# EAGLE design usb2serial-pic14f1454 (EAGLE 7.6.0)
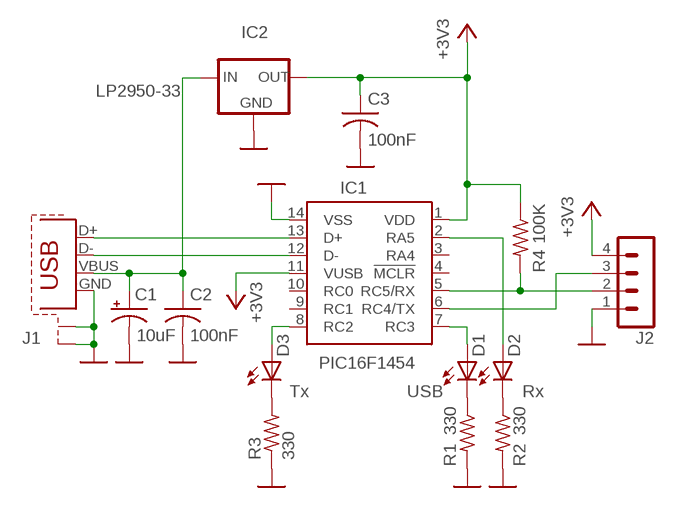
[diagram p0: schematic, sheet 1]

## Parts
C1  10uF  CPOL-USE2-4  [E2-4]
C2  100nF  C-US050-025X075  [C050-025X075]
C3  100nF  C-US050-025X075  [C050-025X075]
D1  LED5MM  [LED5MM]
D2  LED5MM  [LED5MM]
D3  LED5MM  [LED5MM]
IC1  PIC16F1454  [DIL14]
IC2  LP2950-33  78LXX  [78LXX]
J1  USB-SHIELD-A-H  [USB-A-H]
J2  J2  MA04-1  [MA04-1]
R1  330  R-US_0207/10  [0207/10]
R2  330  R-US_0207/10  [0207/10]
R3  330  R-US_0207/10  [0207/10]
R4  100K  R-US_0207/10  [0207/10]

## Nets
+3V3: C3.1 IC1.1(VDD) IC1.11(VUSB) IC2.OUT J2.4 R4.1
GND: C1.- C2.2 C3.2 IC1.14(VSS) IC2.GND J1.GND J1.GND2(S1) J1.GND3(S2) J2.1 R1.2 R2.2 R3.1
N$1: IC1.12(D-) J1.D-
N$2: IC1.13(D+) J1.D+
N$3: IC1.5(RC5/RX) J2.2 R4.2
N$4: D3.K(C) R3.2
N$5: D2.K(C) R2.1
N$6: C1.+ C2.1 IC2.IN J1.VBUS
N$9: D1.A IC1.7(RC3)
N$10: D1.K(C) R1.1
RA5: D2.A IC1.2(RA5)
RC2: D3.A IC1.8(RC2)
TX: IC1.6(RC4/TX) J2.3
Unconnected: IC1.3(RA4) IC1.4(!MCLR) IC1.9(RC1) IC1.10(RC0)

## Notes on the sheet
- Tx | USB | Rx

## Library data of the parts
C1 = rcl:CPOL-US: POLARIZED CAPACITOR, American symbol
C2 C3 = rcl:C-US: CAPACITOR, American symbol
D1-D3 = led:LED: LED OSRAM: - CHIPLED LG R971, LG N971, LY N971, LG Q971, LY Q971, LO R971, LY R971 LH N974, LH R974 LS Q976, LO Q976, LY Q976 LO Q996 - Hyper CHIPLED LW Q18S LB Q993, LB Q99A, LB R99A - SideLED LS A670, LO A670, LY A670, LG A670, LP A670 LB A673, LV A673, LT A673, LW A673 LH A674 LY A675 LS A676, LA A676, LO A676, LY A676, LW A676 LS A679, LY A679, LG A679 - Hyper Micro SIDELED® LS Y876, LA Y876, LO Y876, LY Y876 LT Y87S - SmartLED LW L88C, LW L88S LB L89C, LB L89S, LG L890 LS L89K, LO L89K, LY L89K LS L896, LA L896, LO L896, LY L896 - TOPLED LS T670, LO T670, LY T670, LG T670, LP T670 LSG T670, LSP T670, LSY T670, LOP T670, LYG T670 LG T671, LOG T671, LSG T671 LB T673, LV T673, LT T673, LW T673 LH T674 LS T676, LA T676, LO T676, LY T676, LB T676, LH T676, LSB T676, LW T676 LB T67C, LV T67C, LT T67C, LS T67K, LO T67K, LY T67K, LW E67C LS E67B, LA E67B, LO E67B, LY E67B, LB E67C, LV E67C, LT E67C LW T67C LS T679, LY T679, LG T679 LS T770, LO T770, LY T770, LG T770, LP T770 LB T773, LV T773, LT T773, LW T773 LH T774 LS E675, LA E675, LY E675, LS T675 LS T776, LA T776, LO T776, LY T776, LB T776 LHGB T686 LT T68C, LB T68C - Hyper Mini TOPLED® LB M676 - Mini TOPLED Santana® LG M470 LS M47K, LO M47K, LY M47K Source: http://www.osram.convergy.de/
IC1 = obddiag-net:PIC16F1454
IC2 = v-reg:78LXX: VOLTAGE REGULATOR
J1 = obddiag-net:USB-SHIELD
J2 = con-lstb:MA04-1: PIN HEADER; OC_FARNELL: unknown; OC_NEWARK: unknown
R1-R4 = rcl:R-US_: RESISTOR, American symbol

## Board
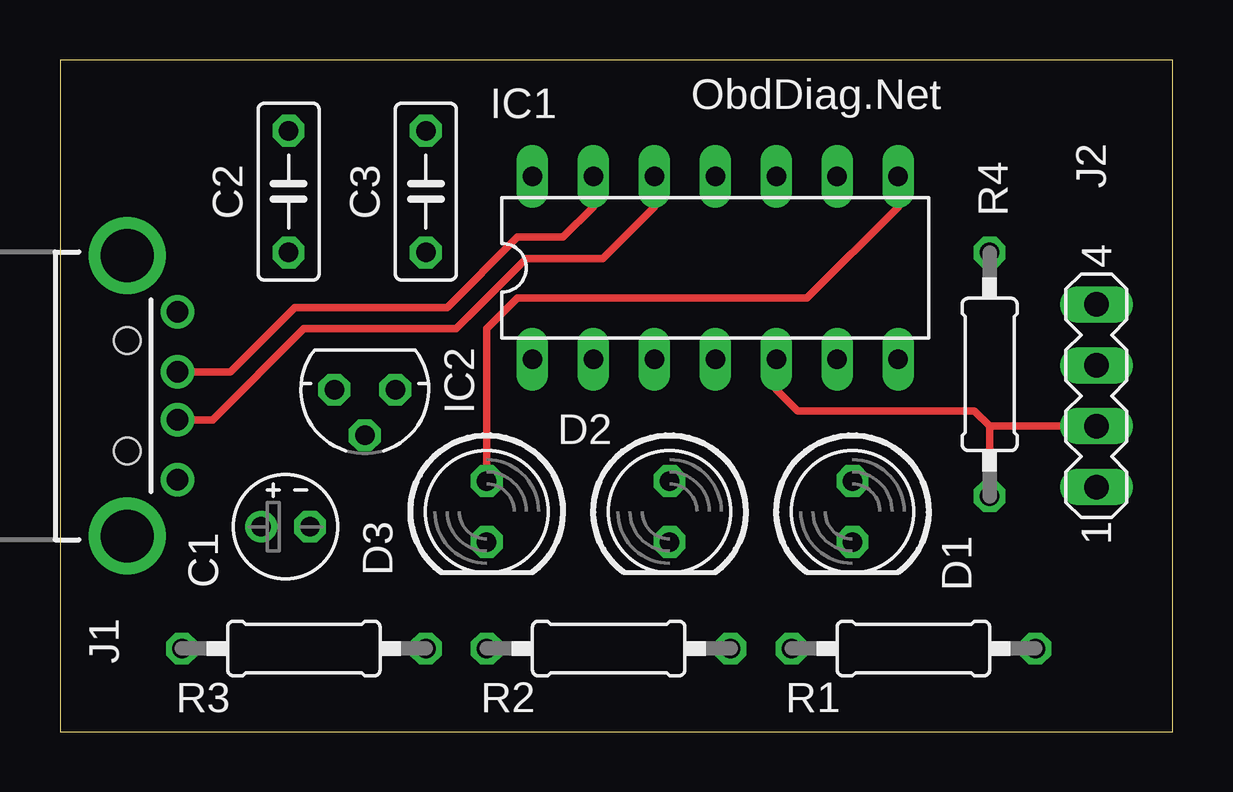
[diagram p1: board, top side]
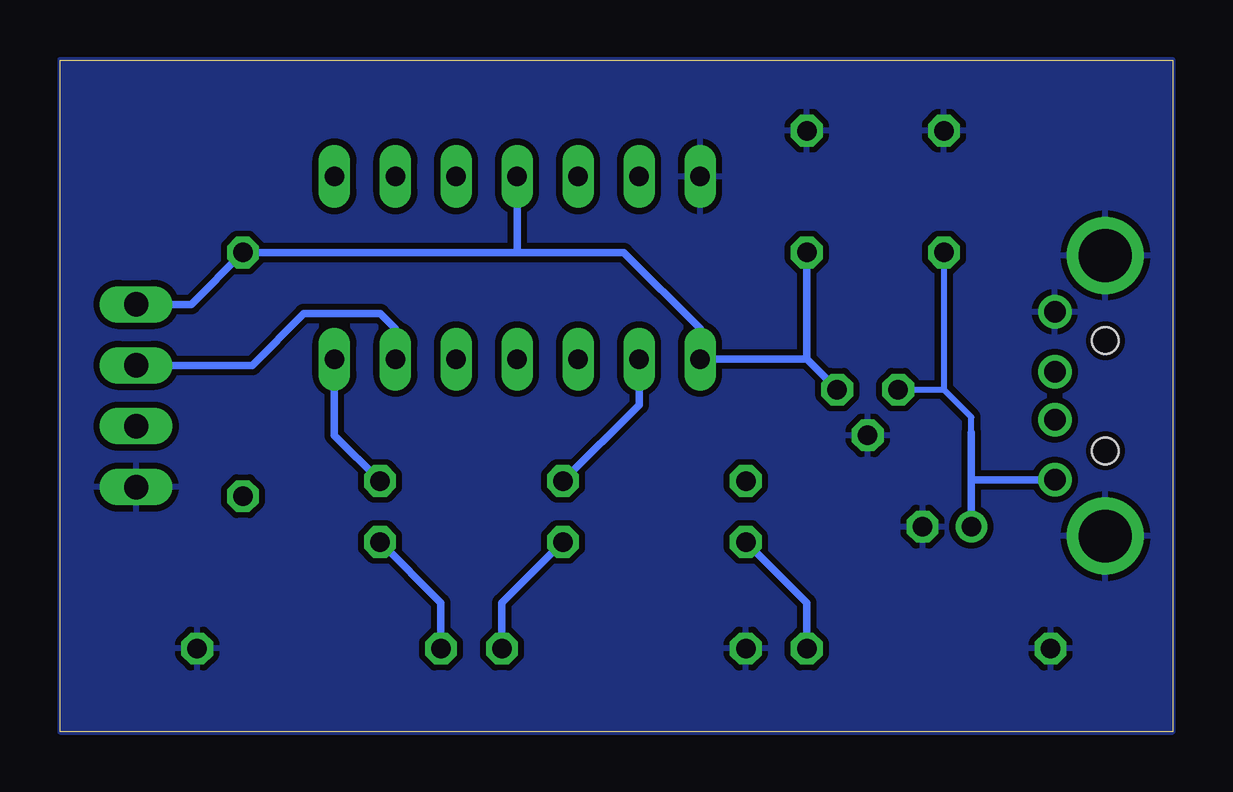
[diagram p2: board, bottom side, seen from below]

Size 46.35 x 28 mm. Coordinates in mm from the lower left corner, seen from the top.
Outline: 0,0 46.35,0 46.35,28 0,28 0,0
Copper layers (1*16): Top 0.035mm / dielectric 1.5mm / Bottom 0.035mm
Design rules "default": minimum track width 10mil, minimum drill 24mil, track to track 8mil, track to pad 8mil, pad to pad 8mil, via to via 8mil, smd to smd 8mil, copper to edge 0mil, drill to drill 8mil, minimum pad ring 10mil, minimum via ring 8mil, stop-mask expansion 4mil, vias tented up to drill 0mil, thermal gap 10mil

### Footprints (pad centres in the part's own frame; a part is rotated, then mirrored left to right if it is on the bottom)
E2-4 = drill 0.813 pad 1.27: + -1.016,0 | drill 0.813 pad 1.27 octagon: - 1.016,0
C050-025X075 = drill 0.813 octagon: 1 -2.54,0; 2 2.54,0
LED5MM = drill 0.813 octagon: A -1.27,0; K 1.27,0
DIL14 = drill 0.813 long: 1 -7.62,-3.81; 2 -5.08,-3.81; 3 -2.54,-3.81; 4 0,-3.81; 5 2.54,-3.81; 6 5.08,-3.81; 7 7.62,-3.81; 8 7.62,3.81; 9 5.08,3.81; 10 2.54,3.81; 11 0,3.81; 12 -2.54,3.81; 13 -5.08,3.81; 14 -7.62,3.81
78LXX = drill 0.813 octagon: GND 0,1.905; IN 1.27,0; OUT -1.27,0
USB-A-H = drill 0.9: D+ 2.1,1; D- 2.1,-1; GND 2.1,3.5; VBUS 2.1,-3.5 | drill 2.2: GND2 0,-5.85; GND3 0,5.85 | hole 1.1: 0,2.3; 0,-2.3
MA04-1 = drill 1.016 long: 1 -3.81,0; 2 -1.27,0; 3 1.27,0; 4 3.81,0
0207/10 = drill 0.813 octagon: 1 -5.08,0; 2 5.08,0

### Placement (x,y rotation side)
C1  9.4,8.54 0 top
C2  9.53,22.51 90 top
C3  15.24,22.51 90 top
D1  33.02,9.18 270 top
D2  25.4,9.18 270 top
D3  17.78,9.18 270 top
IC1  27.3,19.34 0 top
IC2  12.7,14.26 180 top
J1  2.8,14 0 top
J2  43.18,14 90 top
R1  35.56,3.46 0 top
R2  22.86,3.46 180 top
R3  10.16,3.46 0 top
R4  38.73,14.89 270 top

### Tracks (layer width: path | path; a pad name or v marks a point on that pad's centre or on a via)
+3V3
  Bottom 0.305: C3.1 15.24,15.53 | 27.3,19.97 22.86,19.97 19.68,16.8 IC1.1 15.24,15.53 | 27.3,19.97 R4.1 40.9,17.81 J2.4 | IC1.11 27.3,19.97 | IC2.OUT 15.24,15.53
GND
  pour Bottom (isolate 0.254): 0,0 0,28 46.35,28 46.35,0
N$1
  Top 0.305: J1.D- 6.37,13 10.16,16.8 16.51,16.8 19.43,19.72 22.61,19.72 24.77,21.88 IC1.12
N$2
  Top 0.305: J1.D+ 7.09,15 9.78,17.68 16.13,17.68 19.05,20.61 20.32,20.61 20.95,20.61 22.23,21.88 IC1.13
N$3
  Top 0.305: IC1.5 29.84,14.26 30.73,13.37 38.1,13.37 38.73,12.73 | J2.2 38.73,12.73 | R4.2 38.73,12.73
N$4
  Bottom 0.305: R3.2 15.24,5.37 D3.K
N$5
  Bottom 0.305: D2.K 27.94,5.37 R2.1
N$6
  Bottom 0.254: C2.1 9.53,14.26 | 9.53,14.26 8.38,13.11 8.38,12.48 | IC2.IN 9.53,14.26
  Bottom 0.305: J1.VBUS 8.38,10.5 | C1.+ 8.38,10.5 | 8.38,10.5 8.38,12.48
N$9
  Bottom 0.305: IC1.7 34.92,12.35 D1.A
N$10
  Bottom 0.305: R1.1 30.48,5.37 D1.K
RA5
  Bottom 0.305: IC1.2 22.23,13.62 D2.A
RC2
  Top 0.305: D3.A 17.78,16.8 19.05,18.06 31.11,18.06 34.92,21.88 IC1.8
TX
  Bottom 0.305: IC1.6 32.38,16.8 33.02,17.43 36.2,17.43 38.35,15.27 J2.3

### Text on the board
tNames: ObdDiag.Net